# Altium schematic sheet hv-measurement.SchDoc: hv-measurement
size A4; Date: 05.10.2017; CheckedBy: Nico Bieberich; Author: Leon Loeser; Organization: Baltic Racing; Address1: Zur Schwedenschanze 15; Address2: Haus 18; Address3: 18435 Stralsund; Revision: xx.xx; SheetNumber: 5; SheetTotal: 9; Rules: TODO; ProjectName: Projekt
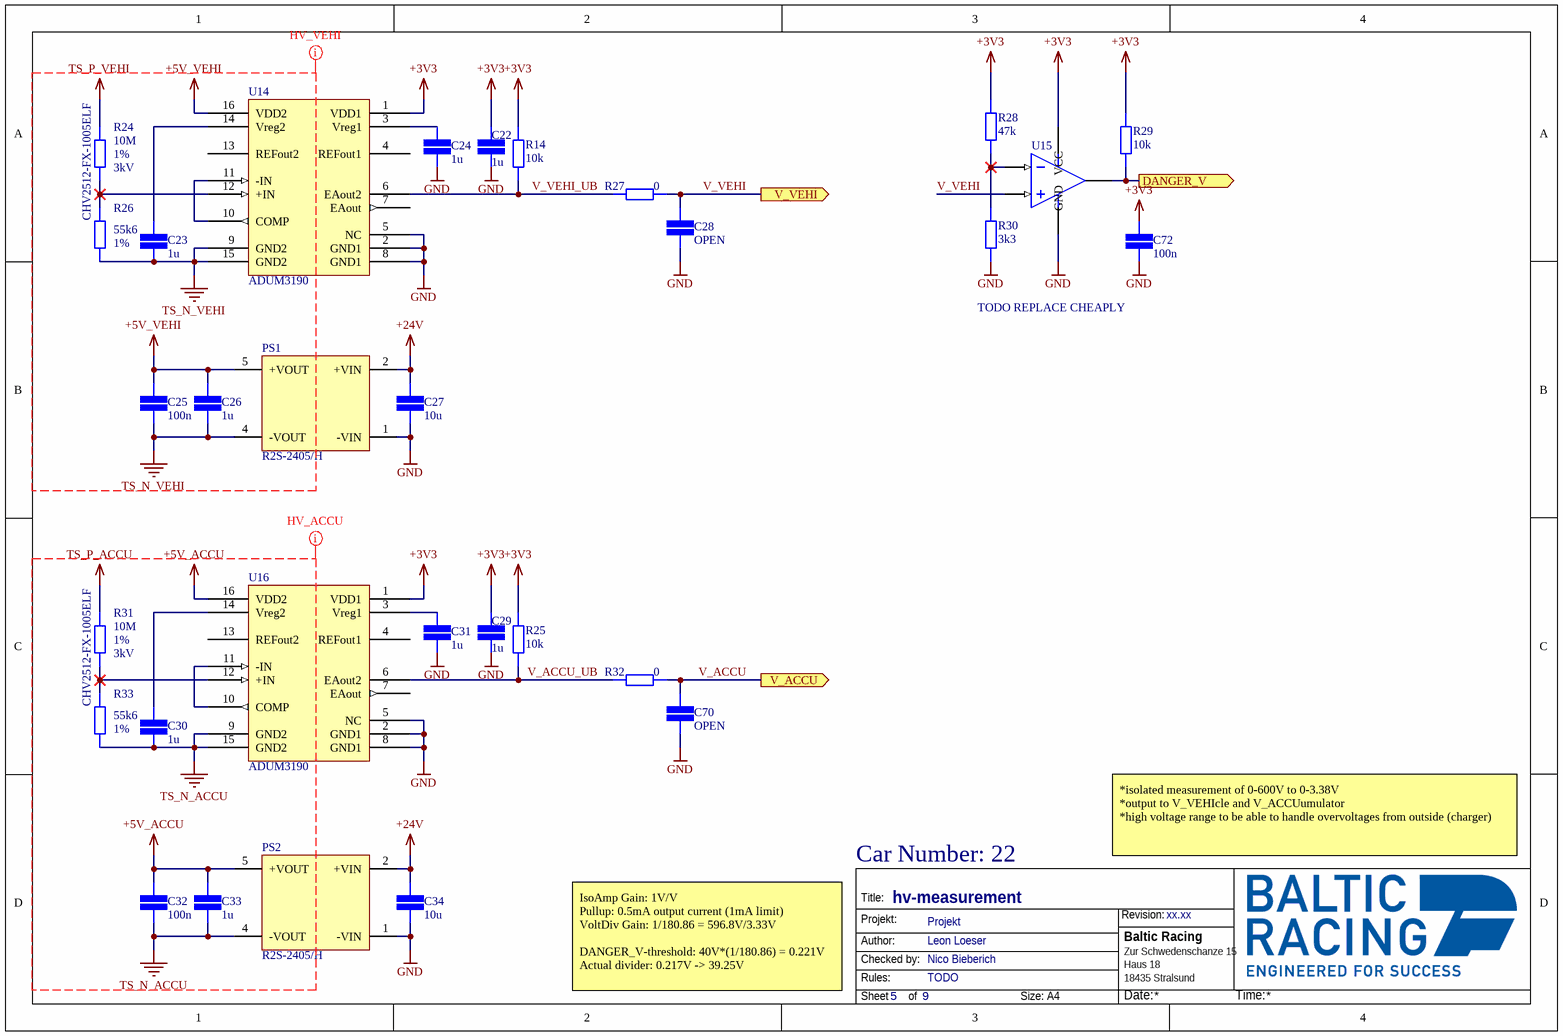
[diagram p0: hv-measurement.SchDoc]

## Parts
C22  value 1u  [CAP 0805/2012]  (hidden comment: SMD Capacitor)
C23  value 1u  [CAP 0805/2012]  (hidden comment: SMD Capacitor)
C24  value 1u  [CAP 0805/2012]  (hidden comment: SMD Capacitor)
C25  value 100n  [CAP 0603/1608]  (hidden comment: SMD Capacitor)
C26  value 1u  [CAP 0805/2012]  (hidden comment: SMD Capacitor)
C27  value 10u  [CAP 1206/3216]  (hidden comment: SMD Capacitor)
C28  value OPEN  [CAP 1206/3216]  (hidden comment: SMD Capacitor)
C29  value 1u  [CAP 0805/2012]  (hidden comment: SMD Capacitor)
C30  value 1u  [CAP 0805/2012]  (hidden comment: SMD Capacitor)
C31  value 1u  [CAP 0805/2012]  (hidden comment: SMD Capacitor)
C32  value 100n  [CAP 0603/1608]  (hidden comment: SMD Capacitor)
C33  value 1u  [CAP 0805/2012]  (hidden comment: SMD Capacitor)
C34  value 10u  [CAP 1206/3216]  (hidden comment: SMD Capacitor)
C70  value OPEN  [CAP 1206/3216]  (hidden comment: SMD Capacitor)
C72  value 100n  [CAP 0603/1608]  (hidden comment: SMD Capacitor)
PS1  R2S-2405/H  [RECOM_R2S]
PS2  R2S-2405/H  [RECOM_R2S]
R14  value 10k  [STACKPOLE CSR0603]  (hidden comment: SMD Resistor)
R24  CHV2512-FX-1005ELF  Tolerance: 1%  Working Voltage: 3kV  Resistance: 10M  [BOURNS_CHV2512]
R25  value 10k  [STACKPOLE CSR0603]  (hidden comment: SMD Resistor)
R26  value 55k6  Tolerance: 1%  [STACKPOLE CSR0603]  (hidden comment: SMD Resistor)
R27  value 0  [STACKPOLE CSR0603]  (hidden comment: SMD Resistor)
R28  value 47k  [STACKPOLE CSR0603]  (hidden comment: SMD Resistor)
R29  value 10k  [STACKPOLE CSR0603]  (hidden comment: SMD Resistor)
R30  value 3k3  [STACKPOLE CSR0603]  (hidden comment: SMD Resistor)
R31  CHV2512-FX-1005ELF  Tolerance: 1%  Working Voltage: 3kV  Resistance: 10M  [BOURNS_CHV2512]
R32  value 0  [STACKPOLE CSR0603]  (hidden comment: SMD Resistor)
R33  value 55k6  Tolerance: 1%  [STACKPOLE CSR0603]  (hidden comment: SMD Resistor)
U14  ADUM3190  [AD_RQ_16]
U15  TODO REPLACE CHEAPLY  [ANALOG_R8]
U16  ADUM3190  [AD_RQ_16]

## Ports
DANGER_V (out), V_ACCU (out), V_VEHI (out)

## Nets
+3V3: C22.1 C29.1 C72.1 R14.2 R25.2 R28.2 R29.2 U14.1(VDD1) U15.7(VCC) U16.1(VDD1)
+5V_ACCU: C32.1 C33.1 PS2.5(+VOUT) U16.16(VDD2)
+5V_VEHI: C25.1 C26.1 PS1.5(+VOUT) U14.16(VDD2)
+24V: C27.2 C34.2 PS1.2(+VIN) PS2.2(+VIN)
GND: C22.2 C24.2 C27.1 C28.2 C29.2 C31.2 C34.1 C70.2 C72.2 PS1.1(-VIN) PS2.1(-VIN) R30.1 U14.2(GND1) U14.5(NC) U14.8(GND1) U15.4(GND) U16.2(GND1) U16.5(NC) U16.8(GND1)
TS_N_ACCU: C30.2 C32.2 C33.2 PS2.4(-VOUT) R33.1 U16.9(GND2) U16.15(GND2)
TS_N_VEHI: C23.2 C25.2 C26.2 PS1.4(-VOUT) R26.1 U14.9(GND2) U14.15(GND2)
TS_P_ACCU: R31.2
TS_P_VEHI: R24.2
DANGER_V: R29.1 U15.6(OUT) ; port DANGER_V
V_ACCU: C70.1 R32.1 ; port V_ACCU
V_ACCU_UB: R25.1 R32.2 U16.6(EAout2)
V_VEHI: C28.1 R27.1 U15.3(+IN) ; port V_VEHI
V_VEHI_UB: R14.1 R27.2 U14.6(EAout2)
NetC23_1: C23.1 U14.14(Vreg2)
NetC24_1: C24.1 U14.3(Vreg1)
NetC30_1: C30.1 U16.14(Vreg2)
NetC31_1: C31.1 U16.3(Vreg1)
NetR24_1: R24.1 R26.2 U14.12(+IN)
NetR28_1: R28.1 R30.2 U15.2(-IN)
NetR31_1: R31.1 R33.2 U16.12(+IN)
NetU14_10: U14.10(COMP) U14.11(-IN)
NetU16_10: U16.10(COMP) U16.11(-IN)

Not connected (* = marked no-connect by the designer): U14 4(REFout1) 7(EAout) 13(REFout2); U16 4(REFout1) 7(EAout) 13(REFout2)

## Layout directives
net class HV_ACCU: +5V_ACCU, TS_N_ACCU, TS_P_ACCU
net class HV_VEHI: +5V_VEHI, TS_N_VEHI, TS_P_VEHI

## Notes on the sheet
- *isolated measurement of 0-600V to 0-3.38V
  *output to V_VEHIcle and V_ACCUumulator
  *high voltage range to be able to handle overvoltages from outside (charger)
- Car Number: 22
- IsoAmp Gain: 1V/V
  Pullup: 0.5mA output current (1mA limit)
  VoltDiv Gain: 1/180.86 = 596.8V/3.33V
  DANGER_V-threshold: 40V*(1/180.86) = 0.221V
  Actual divider: 0.217V -> 39.25V
- Title:
- Projekt:
- Revision:
- Author:
- Rules:
- Checked by:
- Sheet
- of
- Size:
- A4
- Date:
- Time:

## Library data of the parts
C22-C26 C28-C33 C70 C72 = SMD Capacitor: Capacitor with multiple Footprints; Voltage: 6.3V
C27 C34 = SMD Capacitor: Capacitor with multiple Footprints; Voltage: 25V
PS1 PS2 = R2S-2405/H: 2W DC/DC-Converter 'ECONOLINE' SMD 3kV unreg; V. In: 24; V. Out: 05; mA. Out: 400; Manufacturer: Recom; Nominal Input Voltage: 24V; Number of Outputs: 1; Min Input Voltage: 21.6V; Efficiency: 85%; Max Input Voltage: 26.4V; Voltage - Output 1: 5V; Max Output Current: 400mA; Supplier 1: Future Electronics; Manufacturer Part Number: R2S-2405/H; RoHS: Yes; Category: Voltage Regulators - Switching; Pricing 1: 39=17,02000, 78=14,04000, 117=13,79000, 156=13,62000 (USD); Mount: Surface Mount; Case/Package: SMD/SMT; Weight: 1.4g; Min Operating Temperature: -40°C; Max Operating Temperature: 100°C; Output Power: 2W; Packaging: Rail/Tube; Package Quantity: 39; Isolation Voltage: 3kV; Max Power Dissipation: 2W; Max Output Voltage: 5V; Features: SCP; Series: ECONOLINE R2S; Length: 12.75mm; Width: 10.7mm; Height: 8.7mm; RoHS Compliant: Yes; Lead Free: Lead Free; ComponentLink1URL: https://datasheet.ciiva.com/2177/r2s-r2d-2177940.pdf?src-supplier=Digi-Key; ComponentLink1Description: Datasheet; Supplier Part Number 1: 3107800
R14 R25-R30 R32 R33 = SMD Resistor: Resistor with multiple footprints
R24 R31 = CHV2512-FX-1005ELF: Res Thick Film 2512 10M Ohm 1% 1W ±100ppm/°C Molded SMD Paper T/R; Manufacturer: Bourns JW Miller; Voltage Rating: 4kV; Supplier 1: Digi-Key; Manufacturer Part Number: CHV2512-FX-1005ELF; RoHS: Yes; Category: Chip SMD Resistors; Stock 1: 27289; Pricing 1: 1=0,69000, 10=0,50800, 100=0,29600, 1000=0,16600 (USD); Mount: Surface Mount; Case/Package: 2512; Case Code (Metric): 6432; Case Code (Imperial): 2512; Min Operating Temperature: -55°C; Max Operating Temperature: 155°C; Power Rating: 1W; Packaging: Cut Tape; Resistor Type: Thick Film; Number of Terminations: 2; Termination: SMD/SMT; Max Power Dissipation: 1W; Temperature Coefficient: 100ppm/°C; Voltage Rating (DC): 4kV; Length: 0.126inch; Width: 0.252inch; Height: 0.03inch; Depth: 3.2mm; REACH SVHC: No SVHC; RoHS Compliant: Yes; ComponentLink1URL: http://www.farnell.com/datasheets/2059762.pdf?src-supplier=Farnell; ComponentLink1Description: http://www.farnell.com/datasheets/2059762.pdf?src-supplier=Farnell; ComponentLink2URL: http://www.alliedelec.com/images/products/datasheets/bm/BOURNS/70479526.pdf?src-supplier=Allied+Electronics; ComponentLink2Description: http://www.alliedelec.com/images/products/datasheets/bm/BOURNS/70479526.pdf?src-supplier=Allied+Electronics; ComponentLink3URL: http://uk.rs-online.com/webdocs/13ff/0900766b813ff012.pdf?src-supplier=RSComponents; ComponentLink3Description: http://uk.rs-online.com/webdocs/13ff/0900766b813ff012.pdf?src-supplier=RSComponents; ComponentLink4URL: http://www.farnell.com/datasheets/1889918.pdf?src-supplier=Newark; ComponentLink4Description: http://www.farnell.com/datasheets/1889918.pdf?src-supplier=Newark; ComponentLink5URL: http://www.farnell.com/datasheets/2059762.pdf?src-supplier=Element14; ComponentLink5Description: http://www.farnell.com/datasheets/2059762.pdf?src-supplier=Element14; ComponentLink6URL: http://www.bourns.com/docs/Product-Datasheets/CHV.pdf?src-supplier=Digi-Key; ComponentLink6Description: http://www.bourns.com/docs/Product-Datasheets/CHV.pdf?src-supplier=Digi-Key; ComponentLink7URL: http://www.bourns.com/data/global/pdfs/CHV.pdf?src-supplier=Avnet; ComponentLink7Description: http://www.bourns.com/data/global/pdfs/CHV.pdf?src-supplier=Avnet; Supplier Part Number 1: CHV2512-FX-1005ELFCT-ND
U14 U16 = ADUM3190: ANALOG DEVICES - ADUM3190ARQZ - Isolation Amplifier, High Stability Error, 2 Amplifier, 2.5 kV, 3V to 20V, QSOP, 16 Pins; Bandwidth: 10MHz; Max Input Voltage: 1.5V; Common Mode Rejection Ratio: 72dB; -3db Bandwidth: 400kHz; Input Offset Voltage (Vos): 2.5V; Number of Channels: 1; Isolation Voltage: 2.5kV; Input Bias Current: 10nA; Output Current per Channel: 2mA; Max Power Dissipation: 1.64W; Accuracy: 1%; Min Input Voltage: 400mV; Max Output Voltage: 5V; Nominal Supply Current: 2.9mA; Number of Amplifiers: 2; Supplier 1: Digi-Key; Manufacturer: Analog Devices; Manufacturer Part Number: ADUM3190ARQZ; RoHS: Yes; Category: Integrated Circuits (ICs); Stock 1: 9197; Pricing 1: 1=2,92000, 10=2,62400, 25=2,48040, 100=2,14970, 250=2,03944, 500=1,82998, 1000=1,71600 (USD); Mount: Surface Mount; Case/Package: QSOP; Number of Pins: 16; Contact Plating: Tin,Matte; Min Operating Temperature: -40°C; Max Operating Temperature: 85°C; Package Quantity: 98; Packaging: Rail/Tube; Max Supply Voltage: 20V; Min Supply Voltage: 3V; Gain Bandwidth Product: 10MHz; Min Output Voltage: 400mV; Series: iCoupler®; Supply Current: 2.9mA; Amplifier Type: ISOLATION; Power Dissipation: 1.64W; Length: 5mm; Width: 4.01mm; Height: 1.65mm; Radiation Hardening: No; Lead Free: Contains Lead; RoHS Compliant: Yes; REACH SVHC: No SVHC; ComponentLink1URL: https://datasheet.ciiva.com/15065/adum3190-preliminary-01-22-2013-15065104.pdf?src-supplier=Digi-Key; ComponentLink1Description: https://datasheet.ciiva.com/15065/adum3190-preliminary-01-22-2013-15065104.pdf?src-supplier=Digi-Key; ComponentLink2URL: https://datasheet.ciiva.com/22616/1692610-22616320.pdf?src-supplier=Element14; ComponentLink2Description: https://datasheet.ciiva.com/22616/1692610-22616320.pdf?src-supplier=Element14; ComponentLink3URL: https://datasheet.ciiva.com/29892/adum3190-29892631.pdf?src-supplier=Avnet; ComponentLink3Description: https://datasheet.ciiva.com/29892/adum3190-29892631.pdf?src-supplier=Avnet; Supplier Part Number 1: ADUM3190ARQZ-ND
U15 = ADCMP391ARZ: 2.3V-5.5V Single Comparator With Known Power-Up State and Open-Drain output